# Altium project PCB_STM RTC RFID.PrjPcb
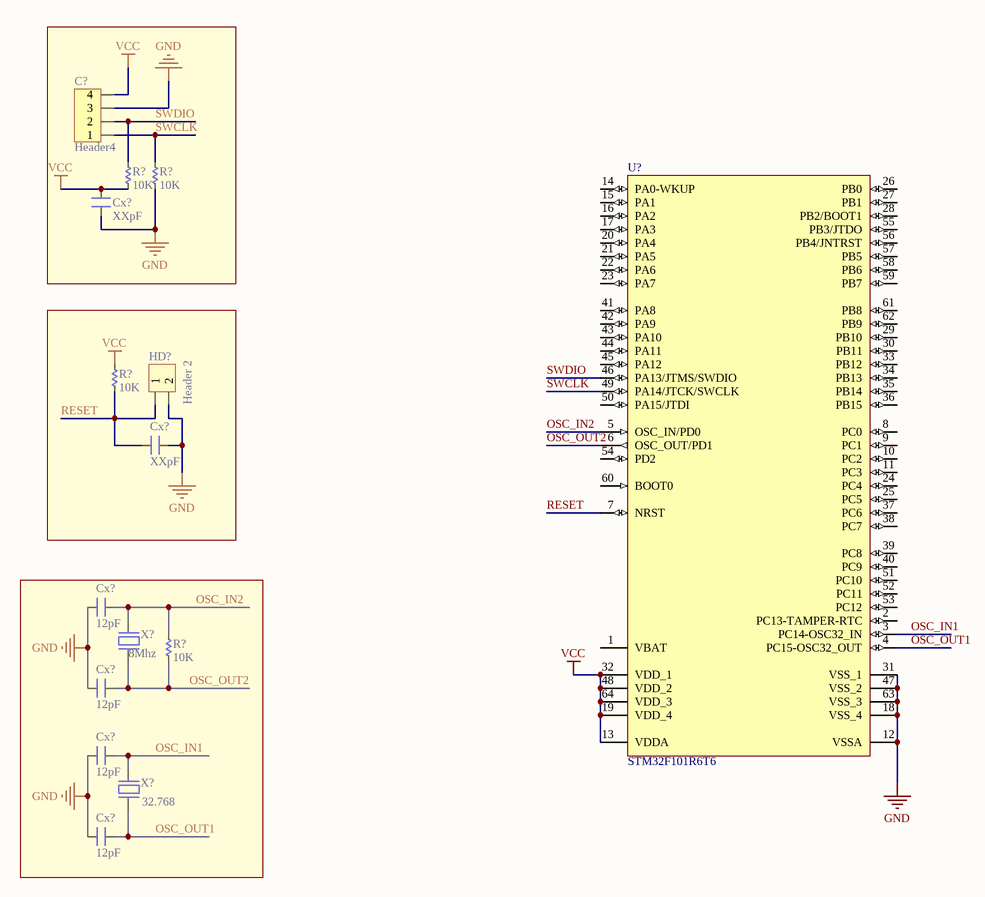
[diagram p0: Sheet1.SchDoc]
1 sheet, 15 parts. Net scope: global (net labels, ports and power ports of the same name join across sheets).

## Sheet Sheet1.SchDoc
size A3

### Parts
(Parts that share a designator on the sheet are numbered #1, #2 ... from top to bottom, then left to right.)
C?  Header4  [HDR4]
Cx?#1  XXpF  [CN-SMD-0805]
Cx?#2  XXpF  [CN-SMD-0805]
Cx?#3  12pF  [CN-SMD-0805]
Cx?#4  12pF  [CN-SMD-0805]
Cx?#5  12pF  [CN-SMD-0805]
Cx?#6  12pF  [CN-SMD-0805]
HD?  Header 2  [HED2]
R?#1  10K  [RES-SMD-0805]
R?#2  10K  [RES-SMD-0805]
R?#3  10K  [RES-SMD-0805]
R?#4  10K  [RES-SMD-0805]
U?  STM32F101R6T6  [TQFP64]
X?#1  8Mhz  [XTAL-RU49/4]
X?#2  32.768  [XTAL-RU49/4]

### Nets
GND: C?.3 Cx?#1.1 Cx?#2.1 Cx?#3.1 Cx?#4.1 Cx?#5.1 Cx?#6.1 HD?.2 R?#2.2 U?.12(VSSA) U?.18(VSS_4) U?.31(VSS_1) U?.47(VSS_2) U?.63(VSS_3)
VCC: C?.4 Cx?#1.2 R?#1.2 R?#3.1 U?.13(VDDA) U?.19(VDD_4) U?.32(VDD_1) U?.48(VDD_2) U?.64(VDD_3)
OSC_IN1: Cx?#5.2 U?.3(PC14-OSC32_IN) X?#2.2
OSC_IN2: Cx?#3.2 R?#4.1 U?.5(OSC_IN/PD0) X?#1.2
OSC_OUT1: Cx?#6.2 U?.4(PC15-OSC32_OUT) X?#2.1
OSC_OUT2: Cx?#4.2 R?#4.2 U?.6(OSC_OUT/PD1) X?#1.1
RESET: Cx?#2.2 HD?.1 R?#3.2 U?.7(NRST)
SWCLK: C?.1 R?#2.1 U?.49(PA14/JTCK/SWCLK)
SWDIO: C?.2 R?#1.1 U?.46(PA13/JTMS/SWDIO)

Not connected (* = marked no-connect by the designer): U? 1(VBAT) 2(PC13-TAMPER-RTC) 8(PC0) 9(PC1) 10(PC2) 11(PC3) 14(PA0-WKUP) 15(PA1) 16(PA2) 17(PA3) 20(PA4) 21(PA5) 22(PA6) 23(PA7) 24(PC4) 25(PC5) 26(PB0) 27(PB1) 28(PB2/BOOT1) 29(PB10) 30(PB11) 33(PB12) 34(PB13) 35(PB14) 36(PB15) 37(PC6) 38(PC7) 39(PC8) 40(PC9) 41(PA8) 42(PA9) 43(PA10) 44(PA11) 45(PA12) 50(PA15/JTDI) 51(PC10) 52(PC11) 53(PC12) 54(PD2) 55(PB3/JTDO) 56(PB4/JNTRST) 57(PB5) 58(PB6) 59(PB7) 60(BOOT0) 61(PB8) 62(PB9)

### Library data of the parts
C? = Header4: Header IDC, 4 x 1 Pin Vertical 2.54mm Pitch (Non-Boxed, Male); Manufacturer: W¨¹rth Elektronik eiSos GmbH; partNo: 613002143121; ComponentLink1 Description: Manufacturer; ComponentLink2 Description: Datasheet; NoPins: 02; Created Date: 29 March 2013; ComponentLink1URL: http://www.we-online.com; ComponentLink2URL: http://katalog.we-online.de/em/datasheet/6130xx143121.pdf; Created by: Karrer Zheng
Cx?#1-Cx?#6 = CN: Value: 33pF
HD? = Hed2: Header 2 (Green); Value: Header 2
R?#1-R?#4 = Res-SMD: Resistor; Manufacturer: Generic Components; Class: Passive; Published: 08/06/2000; Publisher: Altium Hobart Technology Centre
U? = STM32F101R6T6: STM32 ARM-based 32-bit MCU with 32 Kbytes Flash, 64-pin LQFP, Industrial Temperature; Published: 30-May-2008; DatasheetVersion: rev6, Mar-2008; PackageVersion: Mar-2008; PackageReference: LQFP64; Publisher: Altium Limited; PackageDescription: 64-Pin Low-Profile Quad Flat Pack, 10 x 10 mm Body, 0.5 mm Pitch (LQFP64); ComponentLink1Description: Manufacturer Link; ComponentLink1URL: www.st.com/stm32; ComponentLink2Description: Datasheet; ComponentLink2URL: http://www.st.com/stonline/products/literature/ds/13586.pdf
X?#1 X?#2 = XT2: Crystal, 32.768 KHz, -40 to 85 degC, 3.2 x 1.5 x 0.9 mm SMD; Value: 4Mhz